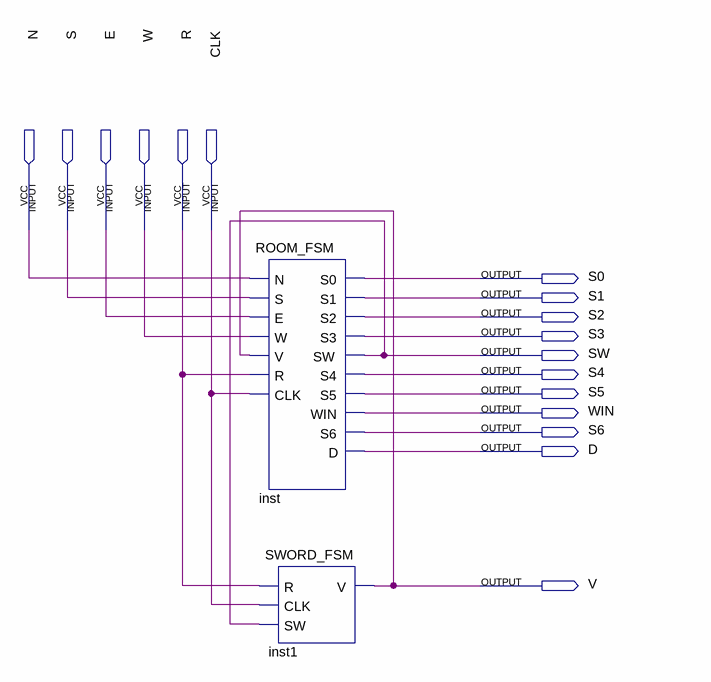
[diagram p0: schematic sheet]
// Quartus schematic lab3.bdf as structural Verilog: 2 symbols, 17 pins
module lab3 (
  input  N,
  input  S,
  input  E,
  input  W,
  input  R,
  input  CLK,
  output S0,
  output S1,
  output S2,
  output S3,
  output SW,
  output S4,
  output S5,
  output WIN,
  output S6,
  output D,
  output V
);

  ROOM_FSM inst (
    .N(N), .S(S), .E(E), .W(W), .V(V), .R(R), .CLK(CLK), .S0(S0), .S1(S1), .S2(S2), .S3(S3), .SW(SW),
    .S4(S4), .S5(S5), .WIN(WIN), .S6(S6), .D(D));
  SWORD_FSM inst1 (.R(R), .CLK(CLK), .SW(SW), .V(V));
endmodule
